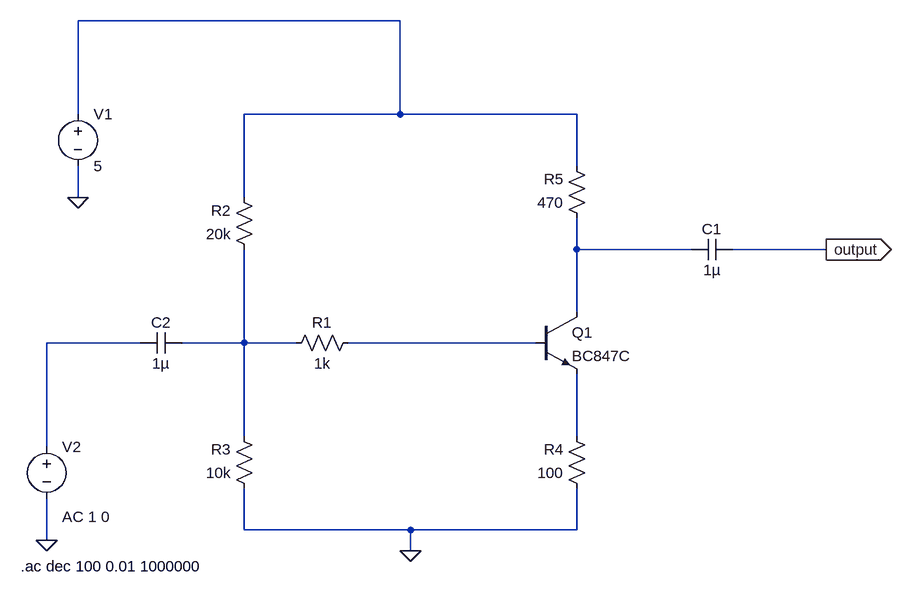
[diagram p0: schematic ac-frekans_analizi.asc]
ac-frekans_analizi.asc, the LTspice schematic file:
Version 4
SHEET 1 1384 848
WIRE 592 -32 96 -32
WIRE 96 112 96 -32
WIRE 592 112 592 -32
WIRE 592 112 352 112
WIRE 864 112 592 112
WIRE 864 192 864 112
WIRE 96 240 96 192
WIRE 352 240 352 112
WIRE 864 320 864 272
WIRE 1040 320 864 320
WIRE 1248 320 1104 320
WIRE 864 416 864 320
WIRE 192 464 48 464
WIRE 352 464 352 320
WIRE 352 464 256 464
WIRE 432 464 352 464
WIRE 800 464 512 464
WIRE 352 608 352 464
WIRE 864 608 864 512
WIRE 48 624 48 464
WIRE 352 752 352 688
WIRE 608 752 352 752
WIRE 864 752 864 688
WIRE 864 752 608 752
WIRE 48 768 48 704
WIRE 608 784 608 752
FLAG 96 240 0
FLAG 48 768 0
FLAG 608 784 0
FLAG 1248 320 output
IOPIN 1248 320 Out
SYMBOL voltage 96 96 R0
WINDOW 123 0 0 Left 0
WINDOW 39 0 0 Left 0
SYMATTR InstName V1
SYMATTR Value 5
SYMBOL voltage 48 608 R0
WINDOW 123 24 124 Left 2
WINDOW 39 0 0 Left 0
SYMATTR InstName V2
SYMATTR Value ""
SYMATTR Value2 AC 1 0
SYMBOL npn 800 416 R0
SYMATTR InstName Q1
SYMATTR Value BC847C
SYMBOL res 528 448 R90
WINDOW 0 0 56 VBottom 2
WINDOW 3 32 56 VTop 2
SYMATTR InstName R1
SYMATTR Value 1k
SYMBOL res 368 336 R180
WINDOW 0 36 76 Left 2
WINDOW 3 36 40 Left 2
SYMATTR InstName R2
SYMATTR Value 20k
SYMBOL res 368 704 R180
WINDOW 0 36 76 Left 2
WINDOW 3 36 40 Left 2
SYMATTR InstName R3
SYMATTR Value 10k
SYMBOL res 880 704 R180
WINDOW 0 36 76 Left 2
WINDOW 3 36 40 Left 2
SYMATTR InstName R4
SYMATTR Value 100
SYMBOL res 880 288 R180
WINDOW 0 36 76 Left 2
WINDOW 3 36 40 Left 2
SYMATTR InstName R5
SYMATTR Value 470
SYMBOL cap 1104 304 R90
WINDOW 0 0 32 VBottom 2
WINDOW 3 32 32 VTop 2
SYMATTR InstName C1
SYMATTR Value 1µ
SYMBOL cap 256 448 R90
WINDOW 0 0 32 VBottom 2
WINDOW 3 32 32 VTop 2
SYMATTR InstName C2
SYMATTR Value 1µ
TEXT 8 808 Left 2 !.ac dec 100 0.01 1000000

The netlist it stands for:
* ac-frekans_analizi.asc
V1 N001 0 5
V2 N003 0 AC 1 0
Q1 N002 N005 N006 0 BC847C
R1 N005 N004 1k
R2 N004 N001 20k
R3 0 N004 10k
R4 0 N006 100
R5 N002 N001 470
C1 output N002 1µ
C2 N004 N003 1µ
.model NPN NPN
.model PNP PNP
.lib standard.bjt
.ac dec 100 0.01 1000000
.backanno
.end